# Altium schematic sheet main.SchDoc
size A3; Название устройства: Voltage detection board
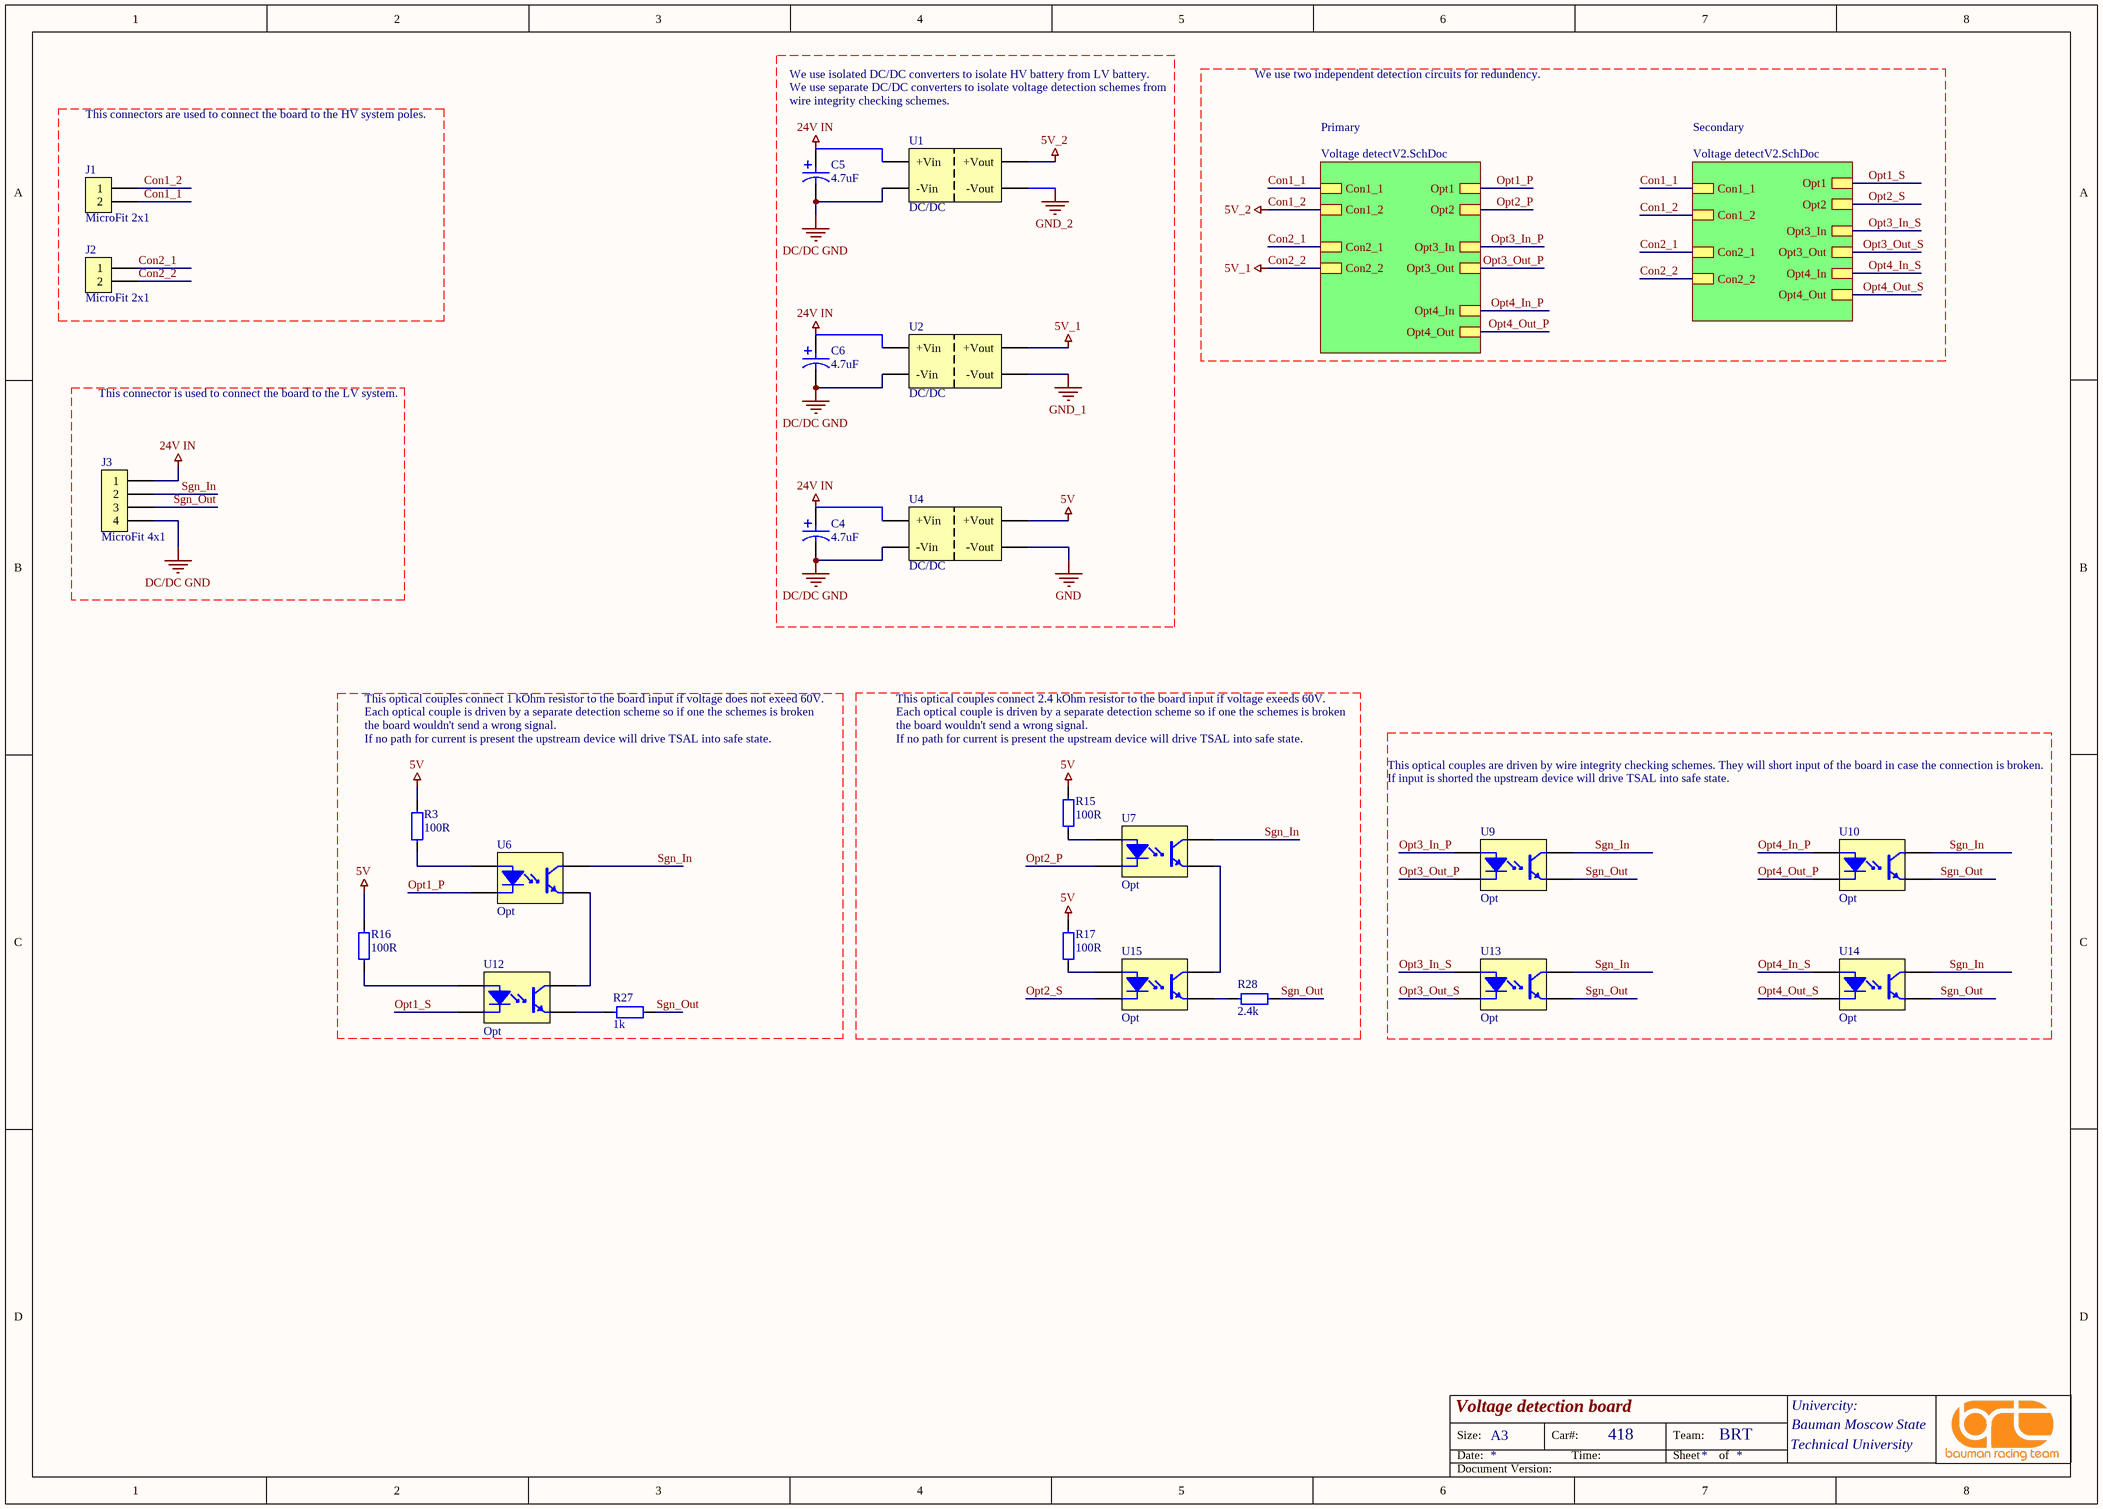
[diagram p0: main.SchDoc]

## Parts
C4  4.7uF  [Bar Cap 4x5.4]
C5  4.7uF  [Bar Cap 4x5.4]
C6  4.7uF  [Bar Cap 4x5.4]
J1  MicroFit 2x1  [MolexMicroFit 2x1]
J2  MicroFit 2x1  [MolexMicroFit 2x1]
J3  MicroFit 4x1  [MolexMicroFit 4x1]
R3  100R  [0805 Resistor]
R15  100R  [0805 Resistor]
R16  100R  [0805 Resistor]
R17  100R  [0805 Resistor]
R27  1k  [0805 Resistor]
R28  2.4k  [0805 Resistor]
U1  DC/DC  [SIP7]
U2  DC/DC  [SIP7]
U4  DC/DC  [SIP7]
U6  Opt  [FAIR-MDIP-4_V]
U7  Opt  [FAIR-MDIP-4_V]
U9  Opt  [FAIR-MDIP-4_V]
U10  Opt  [FAIR-MDIP-4_V]
U12  Opt  [FAIR-MDIP-4_V]
U13  Opt  [FAIR-MDIP-4_V]
U14  Opt  [FAIR-MDIP-4_V]
U15  Opt  [FAIR-MDIP-4_V]

## Sub-sheets
Primary = Voltage detectV2.SchDoc: Opt2, Opt3_In, Opt1, Opt4_Out, Opt4_In, Con2_2, Opt3_Out, Con2_1, Con1_2, Con1_1
Secondary = Voltage detectV2.SchDoc: Opt2, Opt3_In, Opt1, Opt4_Out, Opt4_In, Con2_2, Opt3_Out, Con2_1, Con1_2, Con1_1

## Nets
5V: R3.2 R15.2 R16.2 R17.2 U4.6(+Vout)
24V IN: C4.2 C5.2 C6.2 J3.1 U1.1(+Vin) U2.1(+Vin) U4.1(+Vin)
Con1_2: J1.1 U1.6(+Vout) ; sheet Primary/Con1_2, sheet Secondary/Con1_2  [also labelled 5V_2]
Con2_2: J2.2 U2.6(+Vout) ; sheet Primary/Con2_2, sheet Secondary/Con2_2  [also labelled 5V_1]
DC/DC GND: C4.1 C5.1 C6.1 J3.4 U1.2(-Vin) U2.2(-Vin) U4.2(-Vin)
GND: U4.4(-Vout)
GND_1: U2.4(-Vout)
GND_2: U1.4(-Vout)
Con1_1: J1.2 ; sheet Primary/Con1_1, sheet Secondary/Con1_1
Con2_1: J2.1 ; sheet Primary/Con2_1, sheet Secondary/Con2_1
Opt1_P: U6.2(CATHODE) ; sheet Primary/Opt1
Opt1_S: U12.2(CATHODE) ; sheet Secondary/Opt1
Opt2_P: U7.2(CATHODE) ; sheet Primary/Opt2
Opt2_S: U15.2(CATHODE) ; sheet Secondary/Opt2
Opt3_In_P: U9.1(ANODE) ; sheet Primary/Opt3_In
Opt3_In_S: U13.1(ANODE) ; sheet Secondary/Opt3_In
Opt3_Out_P: U9.2(CATHODE) ; sheet Primary/Opt3_Out
Opt3_Out_S: U13.2(CATHODE) ; sheet Secondary/Opt3_Out
Opt4_In_P: U10.1(ANODE) ; sheet Primary/Opt4_In
Opt4_In_S: U14.1(ANODE) ; sheet Secondary/Opt4_In
Opt4_Out_P: U10.2(CATHODE) ; sheet Primary/Opt4_Out
Opt4_Out_S: U14.2(CATHODE) ; sheet Secondary/Opt4_Out
Sgn_In: J3.2 U6.4(COLLECTOR) U7.4(COLLECTOR) U9.4(COLLECTOR) U10.4(COLLECTOR) U13.4(COLLECTOR) U14.4(COLLECTOR)
Sgn_Out: J3.3 R27.2 R28.2 U9.3(EMITTER) U10.3(EMITTER) U13.3(EMITTER) U14.3(EMITTER)
NetR3_1: R3.1 U6.1(ANODE)
NetR15_1: R15.1 U7.1(ANODE)
NetR16_1: R16.1 U12.1(ANODE)
NetR17_1: R17.1 U15.1(ANODE)
NetR27_1: R27.1 U12.3(EMITTER)
NetR28_1: R28.1 U15.3(EMITTER)
NetU6_3: U6.3(EMITTER) U12.4(COLLECTOR)
NetU7_3: U7.3(EMITTER) U15.4(COLLECTOR)

## Notes on the sheet
- We use isolated DC/DC converters to isolate HV battery from LV battery.
- We use separate DC/DC converters to isolate voltage detection schemes from
- wire integrity checking schemes.
- We use two independent detection circuits for redundency.
- This connectors are used to connect the board to the HV system poles.
- This connector is used to connect the board to the LV system.
- This optical couples connect 1 kOhm resistor to the board input if voltage does not exeed 60V.
- Each optical couple is driven by a separate detection scheme so if one the schemes is broken
- This optical couples connect 2.4 kOhm resistor to the board input if voltage exeeds 60V.
- the board wouldn't send a wrong signal.
- If no path for current is present the upstream device will drive TSAL into safe state.
- (near R15) If no path for current is present the upstream device will drive TSAL into safe state.
- This optical couples are driven by wire integrity checking schemes. They will short input of the board in case the connection is broken.
- If input is shorted the upstream device will drive TSAL into safe state.
- Size:
- Date:
- A3
- Car#:
- Time:
- 418
- Team:
- Sheet
- BRT
- of
- Technical University
- Univercity:
- Bauman Moscow State
- Document Version:

## Library data of the parts
C4-C6 = Cap Pol 4.7uF: ECAP SMD,  35V, 105°C; Part Number: B41121A7475M000; Manufacturer: Epcos; Type: Capacitor; ComponentLink1Description: Chip&Dip; ComponentLink1URL: https://www.chipdip.ru/product/b41121a7475m000
J1 J2 = Conn 2 [MicroFit]: Micro-Fit 3.0 Right-Angle Header, 3.00mm Pitch, Single Row, 2 Circuits, with Snap-in Plastic Peg PCB Lock, Tin, Glow-Wire Capable, Black; Part Number: 436500200; Manufacturer: Molex; ComponentLink1Description: Molex; ComponentLink1URL: https://www.molex.com/molex/products/part-detail/pcb_headers/0436500200; Type: Connector
J3 = Conn 4 [MicroFit]: Micro-Fit 3.0 Right-Angle Header, 3.00mm Pitch, Single Row, 4 Circuits, with Snap-in Plastic Peg PCB Lock, Tin, Glow-Wire Capable, Black; Part Number: 436500400; Manufacturer: Molex; ComponentLink1Description: Molex; ComponentLink1URL: https://www.molex.com/molex/products/part-detail/pcb_headers/0436500400; Type: Connector
R3 R15-R17 = Res 100R (0805): 0.125W 0805 100R, 1%; Part Number: RC0805FR-07100RL; Manufacturer: Taiwan; Type: Resistor; ComponentLink1Description: Chip&Dip; ComponentLink1URL: https://www.chipdip.ru/product0/9000079462
R27 = Res 1k (0805): 0.125W 0805 1k, 1%; Part Number: RC0805FR-071KL; Manufacturer: Taiwan; Type: Resistor; ComponentLink1Description: Chip&Dip; ComponentLink1URL: https://www.chipdip.ru/product0/9000079486
R28 = Res 2.4k (0805): 0.125W 0805 2.4k, 1%; Part Number: RC0805FR-072K4L; Manufacturer: Taiwan; Type: Resistor; ComponentLink1Description: Chip&Dip; ComponentLink1URL: https://www.chipdip.ru/product0/9000079495
U1 U2 U4 = DC/DC Isolated 24V-5V [TMH]: The TMH series are ultra miniature, isolated 2 Watt DC/DC-converters in a Single-in-Line  package  (SIP); Manufacturer: Traco Power; Part Number: TMH2405S; ComponentLink1Description: Chip&Dip; ComponentLink1URL: https://www.chipdip.ru/product/tmh-2405s; ComponentLink2Description: DataSheet; ComponentLink2URL: https://static.chipdip.ru/lib/005/DOC001005854.pdf; Type: IC
U6 U7 U9 U10 U12-U15 = Optocoupler [FOD817B]: Phototransistor Optocoupler, 4 us Rise, 3 us Fall, 5000 Vrms, -55 to 110 degC, 4-Pin MDIP, RoHS, Tape and Reel; Manufacturer: ON Semiconductor; Part Nomber: FOD817B; ComponentLink1Description: Chip&Dip; ComponentLink1URL: https://www.chipdip.ru/product/fod817b; ComponentLink2Description: DataSheet; ComponentLink2URL: https://static.chipdip.ru/lib/297/DOC000297284.pdf